# EAGLE design FootKeyboardStandard (EAGLE 7.5.0)
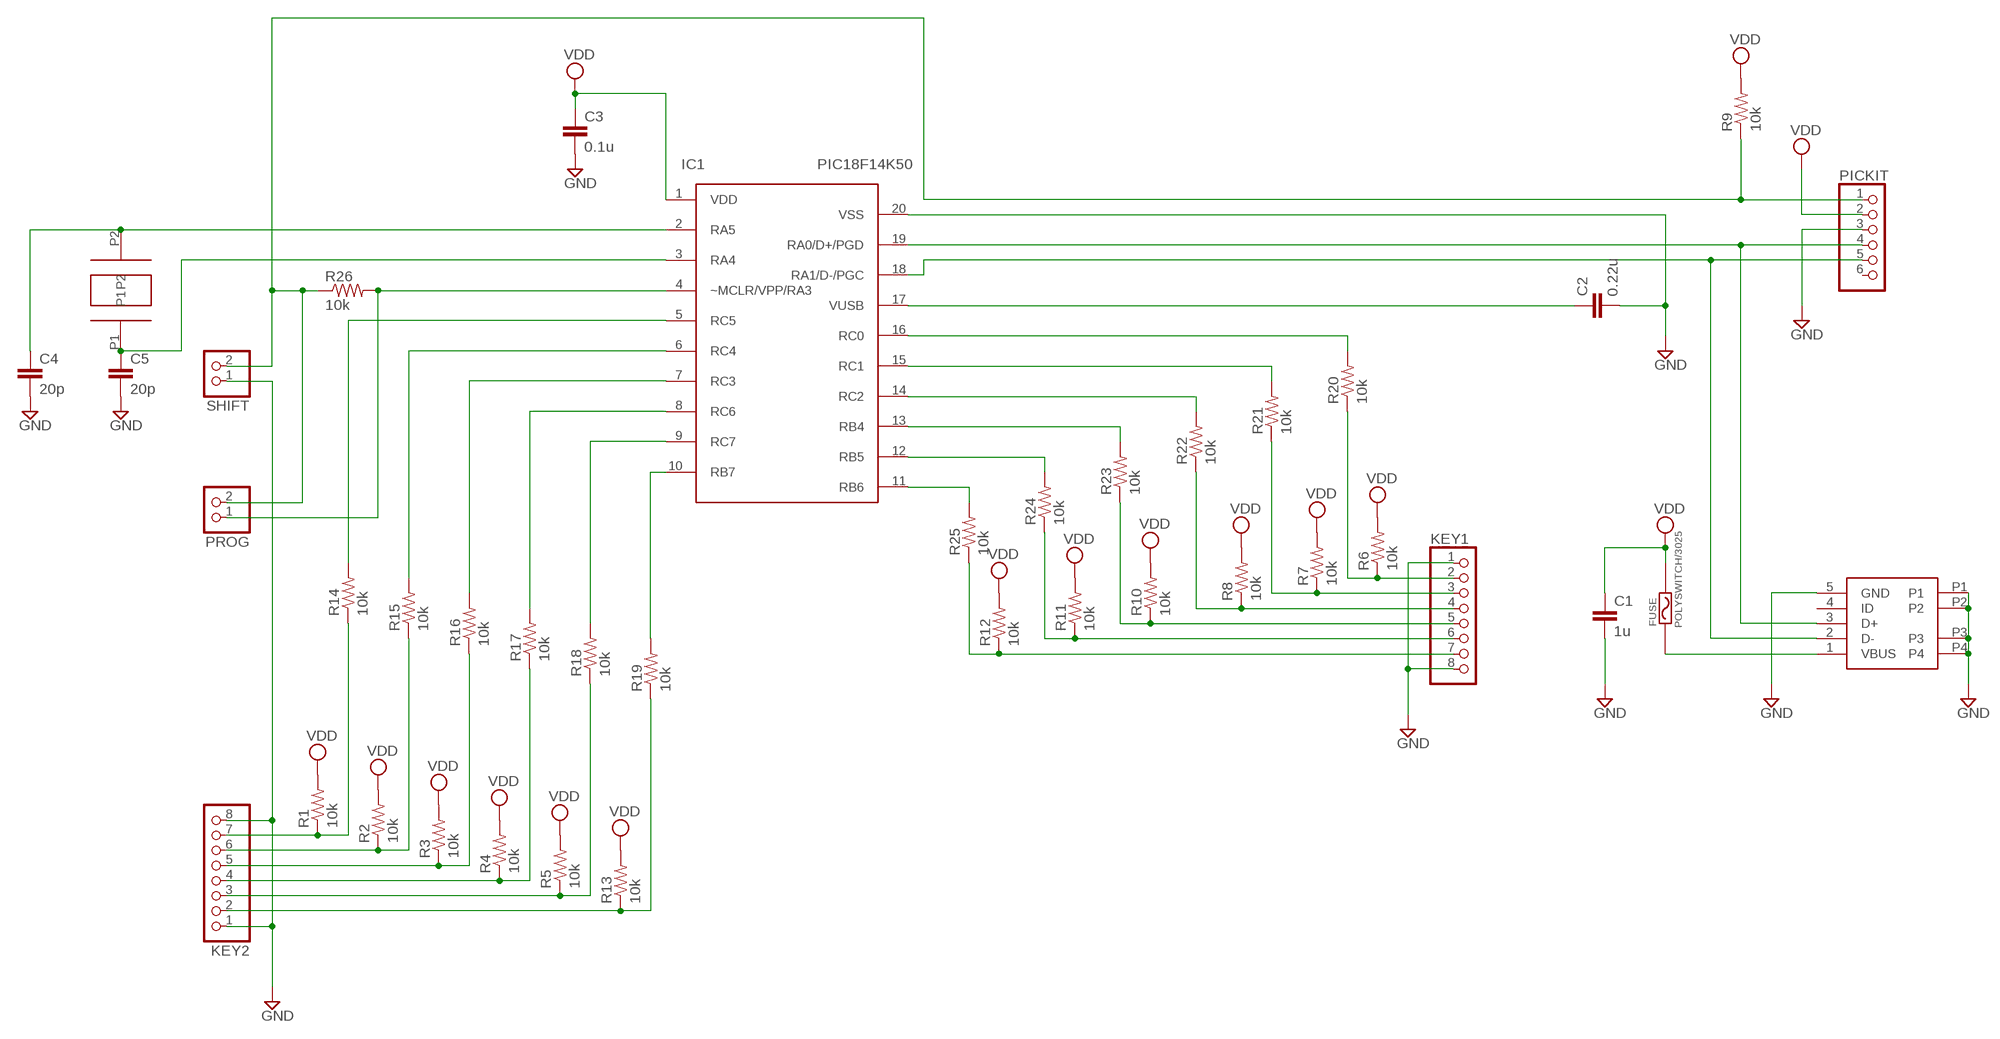
[diagram p0: schematic, sheet 1]

## Parts
C1  1u  C-EU025-025X050  [C025-025X050]
C2  0.22u  C-EU025-025X050  [C025-025X050]
C3  0.1u  C-EU025-025X050  [C025-025X050]
C4  20p  C-EU025-025X050  [C025-025X050]
C5  20p  C-EU025-025X050  [C025-025X050]
FUSE  POLYSWITCH/3025  [SMD/30X25]
IC1  PIC18F14K50  PIC18F1XK50DIP  [DIL20]
KEY1  PINHD-1X8  [1X08]
KEY2  PINHD-1X8  [1X08]
PICKIT  PINHD-1X6  [1X06]
PROG  PINHD-1X2  [1X02]
R1  10k  R-US_0204/7  [0204/7]
R2  10k  R-US_0204/7  [0204/7]
R3  10k  R-US_0204/7  [0204/7]
R4  10k  R-US_0204/7  [0204/7]
R5  10k  R-US_0204/7  [0204/7]
R6  10k  R-US_0204/7  [0204/7]
R7  10k  R-US_0204/7  [0204/7]
R8  10k  R-US_0204/7  [0204/7]
R9  10k  R-US_0204/7  [0204/7]
R10  10k  R-US_0204/7  [0204/7]
R11  10k  R-US_0204/7  [0204/7]
R12  10k  R-US_0204/7  [0204/7]
R13  10k  R-US_0204/7  [0204/7]
R14  10k  R-US_0204/7  [0204/7]
R15  10k  R-US_0204/7  [0204/7]
R16  10k  R-US_0204/7  [0204/7]
R17  10k  R-US_0204/7  [0204/7]
R18  10k  R-US_0204/7  [0204/7]
R19  10k  R-US_0204/7  [0204/7]
R20  10k  R-US_0204/7  [0204/7]
R21  10k  R-US_0204/7  [0204/7]
R22  10k  R-US_0204/7  [0204/7]
R23  10k  R-US_0204/7  [0204/7]
R24  10k  R-US_0204/7  [0204/7]
R25  10k  R-US_0204/7  [0204/7]
R26  10k  R-US_0204/7  [0204/7]
SHIFT  PINHD-1X2  [1X02]
USB  AKIZUKI-USB-MINI-B  [AKIZUKI-USB-MINI-B]
XTAL  12M  AKIZUKI-XTAL  [AKIZUKI-XTAL]

## Nets
GND: C1.2 C2.2 C3.2 C4.2 C5.2 IC1.20(VSS) KEY1.1 KEY1.8 KEY2.1 KEY2.8 PICKIT.3 SHIFT.1 USB.5(GND) USB.P1 USB.P2 USB.P3 USB.P4
N$1: IC1.19(RA0/D+/PGD) PICKIT.4 USB.3(D+)
N$2: C5.1 IC1.3(RA4) XTAL.P1
N$3: C4.1 IC1.2(RA5) XTAL.P2
N$4: IC1.18(RA1/D-/PGC) PICKIT.5 USB.2(D-)
N$5: IC1.10(RB7) R19.2
N$6 [power]: FUSE.P1 USB.1(VBUS)
N$7: IC1.9(RC7) R18.2
N$9: C2.1 IC1.17(VUSB)
N$10: KEY2.5 R3.1 R16.1
N$11: KEY2.4 R4.1 R17.1
N$12: KEY2.3 R5.1 R18.1
N$13: KEY2.2 R13.1 R19.1
N$14: KEY2.7 R1.1 R14.1
N$15: KEY2.6 R2.1 R15.1
N$16: IC1.8(RC6) R17.2
N$17: IC1.16(RC0) R20.2
N$18: IC1.15(RC1) R21.2
N$19: IC1.14(RC2) R22.2
N$20: KEY1.5 R10.1 R23.1
N$21: KEY1.6 R11.1 R24.1
N$22: KEY1.7 R12.1 R25.1
N$23: IC1.7(RC3) R16.2
N$24: IC1.6(RC4) R15.2
N$25: IC1.5(RC5) R14.2
N$26: KEY1.2 R6.1 R20.1
N$27: KEY1.3 R7.1 R21.1
N$28: KEY1.4 R8.1 R22.1
N$29: IC1.13(RB4) R23.2
N$30: IC1.12(RB5) R24.2
N$31: IC1.11(RB6) R25.2
N$32: PICKIT.1 PROG.2 R9.1 R26.1 SHIFT.2
N$33: IC1.4(~MCLR/VPP/RA3) PROG.1 R26.2
VDD [power]: C1.1 C3.1 FUSE.P2 IC1.1(VDD) PICKIT.2 R1.2 R2.2 R3.2 R4.2 R5.2 R6.2 R7.2 R8.2 R9.2 R10.2 R11.2 R12.2 R13.2
Unconnected: PICKIT.6 USB.4(ID)

## Library data of the parts
C1-C5 = MyParts:C-EU: CAPACITOR, European symbol
FUSE = MyOriginal:POLYSWITCH/3025
IC1 = MyOriginal:PIC18F1XK50: PIC18F1XK50
KEY1 KEY2 = MyOriginal:PINHD-1X8: PIN HEADER
PICKIT = MyParts:PINHD-1X6: PIN HEADER
PROG SHIFT = MyOriginal:PINHD-1X2: PIN HEADER
R1-R26 = MyParts:R-US_: RESISTOR, American symbol
USB = MyOriginal:AKIZUKI-USB-MINI-B
XTAL = MyOriginal:AKIZUKI-XTAL

## Net classes
0 default: width 0.229 mm, clearance 0.203 mm
1 power: width 0.381 mm, clearance 0.203 mm

## Board
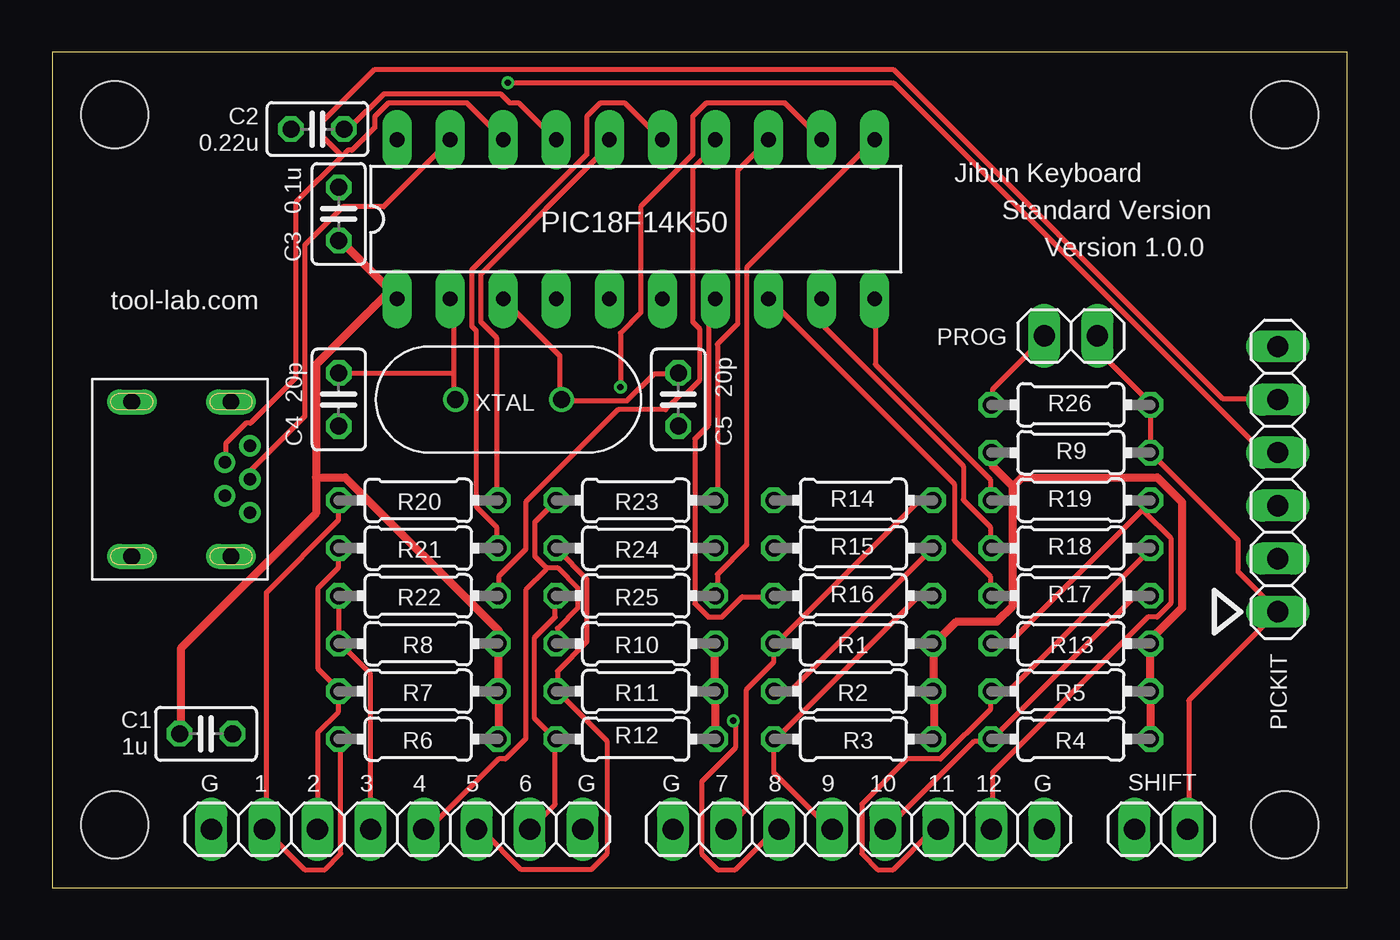
[diagram p1: board, top side]
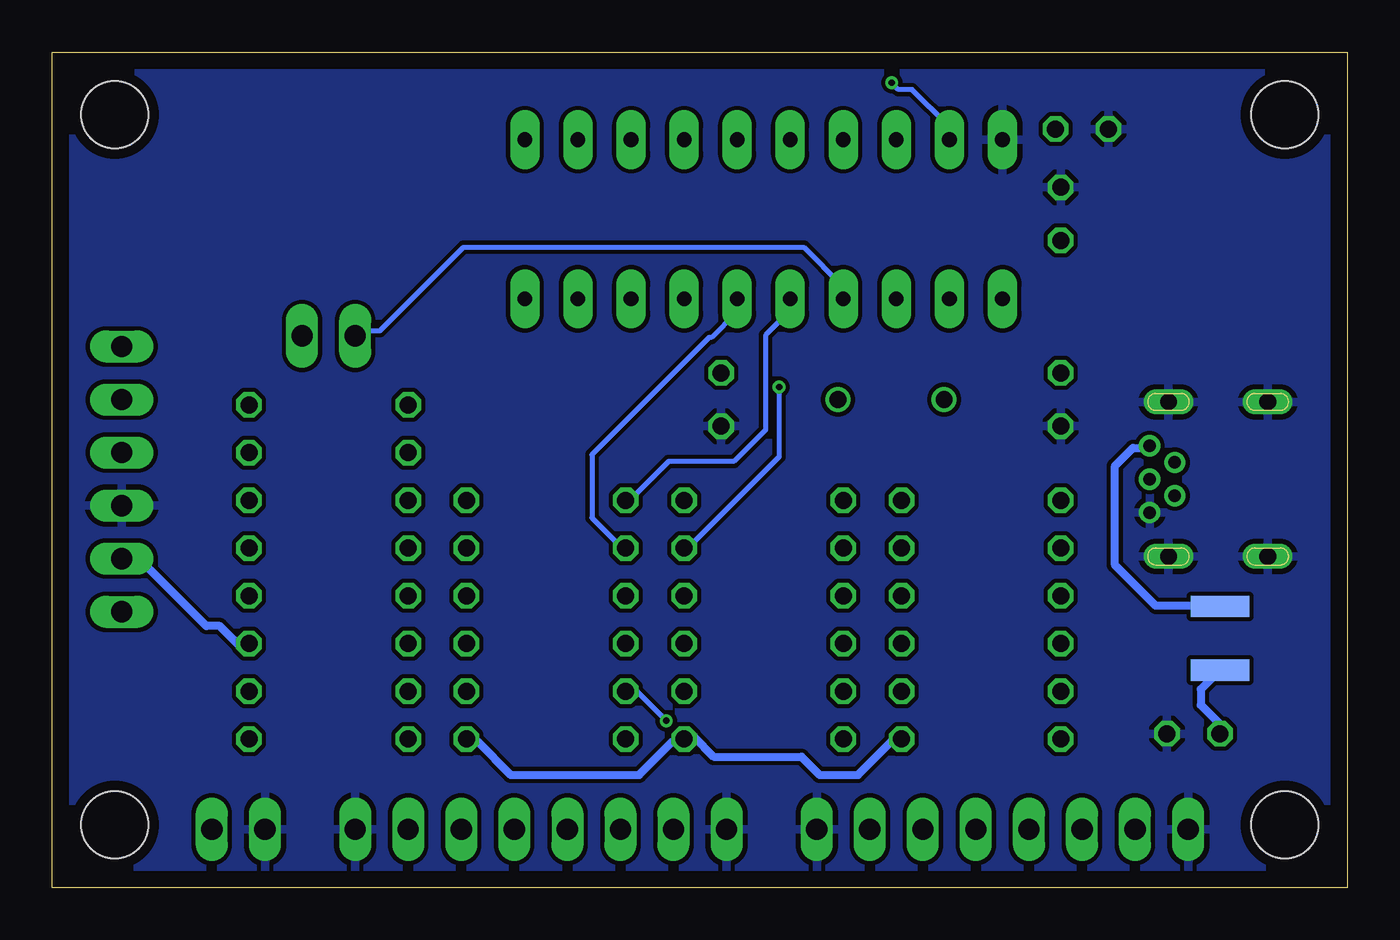
[diagram p2: board, bottom side, seen from below]

Size 62 x 40 mm. Coordinates in mm from the lower left corner, seen from the top.
Outline: 0,0 62,0 62,40 0,40 0,0
Copper layers (1*16): Top 0.035mm / dielectric 1.6mm / Bottom 0.035mm
Design rules "Elecrow_2-layer_PCB_eagle_rule": minimum track width 6mil, minimum drill 12mil, track to track 6mil, track to pad 6mil, pad to pad 6mil, via to via 8mil, smd to smd 0mil, copper to edge 20mil, drill to drill 10mil, minimum pad ring 6mil, minimum via ring 6mil, stop-mask expansion 0mil, vias tented up to drill 100mil, thermal gap 10mil
Holes 3.2 mm at 3,37 3,3 59,37 59,3

### Footprints (pad centres in the part's own frame; a part is rotated, then mirrored left to right if it is on the bottom)
C025-025X050 = drill 0.813 octagon: 1 -1.27,0; 2 1.27,0
SMD/30X25 = smd 1.016 x 2.794: P1 -1.524,0; P2 1.524,0
DIL20 = drill 0.7 pad 1.422 long: 1 -10.16,-3.81; 2 -7.62,-3.81; 3 -5.08,-3.81; 4 -2.54,-3.81; 5 0,-3.81; 6 2.54,-3.81; 7 5.08,-3.81; 8 7.62,-3.81; 9 10.16,-3.81; 10 12.7,-3.81; 11 12.7,3.81; 12 10.16,3.81; 13 7.62,3.81; 14 5.08,3.81; 15 2.54,3.81; 16 0,3.81; 17 -2.54,3.81; 18 -5.08,3.81; 19 -7.62,3.81; 20 -10.16,3.81
1X08 = drill 1.016 long: 1 -8.89,0; 2 -6.35,0; 3 -3.81,0; 4 -1.27,0; 5 1.27,0; 6 3.81,0; 7 6.35,0; 8 8.89,0
1X06 = drill 1.016 long: 1 -6.35,0; 2 -3.81,0; 3 -1.27,0; 4 1.27,0; 5 3.81,0; 6 6.35,0
1X02 = drill 1.016 long: 1 -1.27,0; 2 1.27,0
0204/7 = drill 0.813 octagon: 1 -3.81,0; 2 3.81,0
AKIZUKI-USB-MINI-B = drill 0.6 pad 1.016: 1 -1.6,5.65; 2 -0.8,4.45; 3 0,5.65; 4 0.8,4.45; 5 1.6,5.65 | drill 0.8 long: P1 -3.7,4.75; P2 -3.7,0; P3 3.7,0; P4 3.7,4.75
AKIZUKI-XTAL = drill 0.8: P1 -2.54,0; P2 2.54,0

### Placement (x,y rotation side)
C1  7.37,7.37 0 top
C2  12.7,36.32 180 top
C3  13.72,32.26 90 top
C4  13.72,23.37 270 top
C5  29.97,23.37 270 top
FUSE  6.1,11.94 270 bottom
IC1  26.67,32 0 top
KEY1  16.51,2.79 0 top
KEY2  38.61,2.79 180 top
PICKIT  58.67,19.56 90 top
PROG  48.77,26.42 0 top
R1  38.35,11.68 0 top
R2  38.35,9.4 0 top
R3  38.35,7.11 0 top
R4  48.77,7.11 0 top
R5  48.77,9.4 0 top
R6  17.53,7.11 0 top
R7  17.53,9.4 0 top
R8  17.53,11.68 0 top
R9  48.77,20.83 180 top
R10  27.94,11.68 0 top
R11  27.94,9.4 0 top
R12  27.94,7.11 0 top
R13  48.77,11.68 0 top
R14  38.35,18.54 180 top
R15  38.35,16.26 180 top
R16  38.35,13.97 180 top
R17  48.77,13.97 180 top
R18  48.77,16.26 180 top
R19  48.77,18.54 180 top
R20  17.53,18.54 0 top
R21  17.53,16.26 0 top
R22  17.53,13.97 0 top
R23  27.94,18.54 0 top
R24  27.94,16.26 0 top
R25  27.94,13.97 0 top
R26  48.77,23.11 180 top
SHIFT  53.09,2.79 0 top
USB  3.81,19.56 270 top
XTAL  21.84,23.37 180 top

### Tracks (layer width: path | path; a pad name or v marks a point on that pad's centre or on a via)
GND
  pour Bottom: 1,1 1,39 61,39 61,1
N$1  (via drill 0.3)
  Top 0.229: USB.3 9.5,19.65 9.5,19.97 12.09,22.56 12.09,30.77 13.93,32.6 15.87,32.6 19,35.73 IC1.19 | v21.81,38.54 40.27,38.54 57.97,20.83 58.62,20.83 PICKIT.4
  Bottom 0.229: v21.81,38.54 21.48,38.21 20.83,38.21 19.11,36.49 19.11,35.84 IC1.19
N$2
  Top 0.229: IC1.3 21.59,28.18 24.29,25.48 24.29,23.43 XTAL.P1 24.4,23.32 27.53,23.32 28.82,24.61 29.9,24.61 C5.1
N$3
  Top 0.229: 19.21,24.61 19.21,28.07 19.11,28.18 IC1.2 | 19.21,24.61 19.21,23.43 XTAL.P2 | 19.21,24.61 13.82,24.61 C4.1
N$4
  Top 0.229: 13.87,35.03 14.14,35.3 14.36,35.3 15.44,36.38 15.44,36.92 16.09,37.57 19.86,37.57 21.59,35.84 IC1.18 | 13.87,35.03 11.66,32.82 11.66,24.4 9.5,22.24 9.28,22.24 8.31,21.27 8.31,20.4 USB.2 | 13.87,35.03 12.95,35.95 12.95,36.7 15.44,39.19 40.27,39.19 56.03,23.43 58.62,23.43 PICKIT.5
N$5
  Top 0.229: R19.2 44.91,18.57 44.91,19.54 39.4,25.04 39.4,28.18 IC1.10
N$6
  Bottom 0.381: USB.1 9.5,21.05 10.26,21.05 11.12,20.19 11.12,15.44 9.18,13.49 6.15,13.49 FUSE.P1
N$7
  Top 0.229: R18.2 44.91,16.3 44.91,17.27 43.61,18.57 43.61,20.19 36.92,26.88 36.92,28.18 IC1.9
N$9
  Top 0.229: C2.1 14.03,36.38 14.25,36.38 15.87,38 21.48,38 21.91,37.57 22.35,37.57 24.07,35.84 IC1.17
N$10
  Top 0.229: KEY2.5 37.24,2.81 34.54,5.5 R3.1 34.65,7.12 41.45,13.93 42.1,13.93 R16.1
N$11
  Top 0.229: KEY2.4 39.94,2.81 44.15,7.02 44.91,7.02 R4.1 45.02,7.12 51.82,13.93 52.57,13.93 R17.1
N$12
  Top 0.229: R18.1 52.57,16.19 45.88,9.5 45.02,9.5 R5.1 44.91,9.39 44.91,8.53 42.53,6.15 40.91,6.15 38.75,3.99 38.75,1.62 39.51,0.86 40.27,0.86 42.1,2.7 42.32,2.7 KEY2.3
N$13
  Top 0.229: R13.1 45.02,11.77 45.88,11.77 52.57,18.46 R19.1 52.25,18.03 53.54,16.73 53.54,13.6 52.9,12.95 52.46,12.95 45.02,5.5 45.02,2.81 KEY2.2
N$14
  Top 0.229: KEY2.7 32.28,2.81 33.25,3.78 33.25,9.5 34.54,10.79 R1.1 34.65,11.66 41.45,18.46 42.1,18.46 R14.1
N$15  (via drill 0.3)
  Top 0.229: R15.1 35.41,9.5 34.54,9.5 R2.1 | v32.6,7.99 32.71,7.88 32.71,6.69 31.09,5.07 31.09,1.62 31.84,0.86 32.71,0.86 34.54,2.7 34.76,2.7 KEY2.6
  Bottom 0.229: v32.6,7.99 34,9.39 R2.1
N$16
  Top 0.229: R17.2 44.91,14.03 44.91,14.9 43.18,16.62 43.18,19.32 34.33,28.18 IC1.8
N$17
  Top 0.229: R20.2 21.27,18.57 21.27,26.34 20.51,27.09 20.51,29.36 26.66,35.52 26.66,35.73 IC1.16
N$18
  Top 0.229: R21.2 21.27,16.3 21.27,17.27 20.3,18.24 20.3,26.66 20.08,26.88 20.08,29.58 25.58,35.08 25.58,36.92 26.23,37.57 27.42,37.57 29.15,35.84 IC1.15
N$19
  Top 0.229: R22.2 21.37,14.03 21.37,14.9 22.67,16.19 22.67,18.46 27.09,22.89 29.36,22.89 30.12,23.64 30.33,23.64 30.98,24.29 30.98,26.77 30.66,27.09 30.66,34.44 31.74,35.52 31.74,35.73 IC1.14
N$20
  Top 0.229: 23.64,15.33 24.18,15.33 25.15,14.36 25.15,13.39 24.18,12.41 24.18,11.77 R10.1 | 23.64,15.33 23.1,15.87 23.1,17.49 24.07,18.46 R23.1 | KEY1.5 17.81,2.81 18.03,2.81 21.37,6.15 21.7,6.15 22.67,7.12 22.67,14.25 23.64,15.22 23.64,15.33
N$21
  Top 0.229: R24.1 24.18,16.19 25.58,14.79 25.58,11.77 24.18,10.36 24.18,9.5 R11.1 24.18,9.39 26.56,7.02 26.56,1.62 25.8,0.86 22.45,0.86 20.62,2.7 20.4,2.7 KEY1.6
N$22
  Top 0.229: KEY1.7 22.89,2.81 24.07,3.99 24.07,7.02 R12.1 24.07,7.12 23.1,8.1 23.1,11.98 24.07,12.95 24.07,13.93 R25.1
N$23
  Top 0.229: R16.2 34.54,13.93 33.03,13.93 32.06,12.95 31.41,12.95 30.77,13.6 30.77,21.48 31.41,22.13 31.41,27.85 31.74,28.18 IC1.7
N$24
  Bottom 0.229: R15.2 34.54,16.3 34.76,16.3 36.16,17.7 36.16,20.73 30.55,26.34 30.44,26.34 29.25,27.53 29.25,28.18 IC1.6
N$25
  Bottom 0.229: R14.2 34.54,18.57 34.33,18.57 32.49,20.4 29.36,20.4 27.85,21.91 27.85,26.45 26.77,27.53 26.77,28.18 IC1.5
N$26
  Top 0.229: R6.1 13.82,7.02 13.82,1.62 13.06,0.86 12.09,0.86 KEY1.2 10.26,2.81 10.26,14.14 13.71,17.6 13.71,18.46 R20.1
N$27
  Top 0.229: KEY1.3 12.74,2.81 12.74,7.45 13.71,8.42 R7.1 13.71,9.5 12.74,10.47 12.74,14.36 13.71,15.33 13.71,16.19 R21.1
N$28
  Top 0.229: R22.1 13.71,13.93 13.71,11.77 R8.1 13.82,11.66 15.22,10.26 15.22,2.81 KEY1.4
N$29
  Top 0.229: R23.2 31.84,18.57 31.84,26.02 32.82,26.99 32.82,34.33 34.22,35.73 IC1.13
N$30  (via drill 0.3)
  Top 0.229: v27.2,23.96 27.2,26.56 28.18,27.53 28.18,32.6 30.66,35.08 30.66,36.92 31.3,37.57 35.08,37.57 36.81,35.84 IC1.12
  Bottom 0.229: v27.2,23.96 27.2,20.62 31.52,16.3 31.74,16.3 R24.2
N$31
  Top 0.229: R25.2 31.84,14.03 31.84,15.01 33.25,16.41 33.25,29.69 39.29,35.73 IC1.11
N$32
  Top 0.229: PROG.2 50.09,26.34 50.09,25.69 52.57,23.21 R26.1 R9.1 56.78,16.62 56.78,15.11 58.62,13.28 PICKIT.1 58.62,13.17 54.41,8.96 54.41,2.81 SHIFT.2
N$33
  Top 0.229: R26.2 45.02,23.21 45.02,23.86 47.5,26.34 PROG.1
  Bottom 0.229: IC1.4 24.18,28.28 24.18,28.82 26.02,30.66 42.32,30.66 46.31,26.66 47.28,26.66 47.5,26.45 PROG.1
VDD
  Top 0.381: R6.2 21.37,7.12 21.37,9.39 R7.2 21.37,9.5 21.37,11.66 R8.2 21.37,11.87 21.37,12.31 14.03,19.65 12.63,19.65 | C3.1 13.82,30.98 16.52,28.28 IC1.1 16.09,28.5 12.63,25.04 12.63,19.65 | 12.63,19.65 12.63,17.92 6.15,11.44 6.15,7.45 C1.1 | R4.2 52.57,7.12 R5.2 52.57,9.5 52.57,11.66 R13.2 52.57,11.87 54.08,13.39 54.08,18.46 52.9,19.65 46.42,19.65 45.99,19.21 | R12.2 31.74,7.12 31.74,9.39 R11.2 31.74,9.5 31.74,11.66 R10.2 | R3.2 42.21,7.12 42.21,9.39 R2.2 42.21,9.5 42.21,11.66 R1.2 42.32,11.77 43.29,12.74 45.23,12.74 45.99,13.49 45.99,19.21 | 45.99,19.21 45.02,20.19 45.02,20.73 R9.2
  Bottom 0.381: C1.1 6.15,7.45 6.15,7.88 7.02,8.74 7.02,9.5 6.15,10.36 FUSE.P2 | PICKIT.2 58.62,15.65 57.75,15.65 54.62,12.52 53.98,12.52 53,11.55 52.79,11.55 52.68,11.66 R13.2 | R3.2 42.1,7.02 41.67,7.02 40.05,5.4 33.9,5.4 32.28,7.02 31.84,7.02 R12.2 31.63,7.23 31.3,7.23 30.33,6.26 26.12,6.26 25.26,5.4 23.43,5.4 21.81,7.02 21.37,7.02 R6.2

### Text on the board
tPlace: Jibun Keyboard | Standard Version | Version 1.0.0 | tool-lab.com | G | 1 | 2 | 3 | 4 | 5 | 6 | G | G | 7 | 8 | 9 | 10 | 11 | 12 | G